# Altium schematic sheet main_board.SchDoc
size A
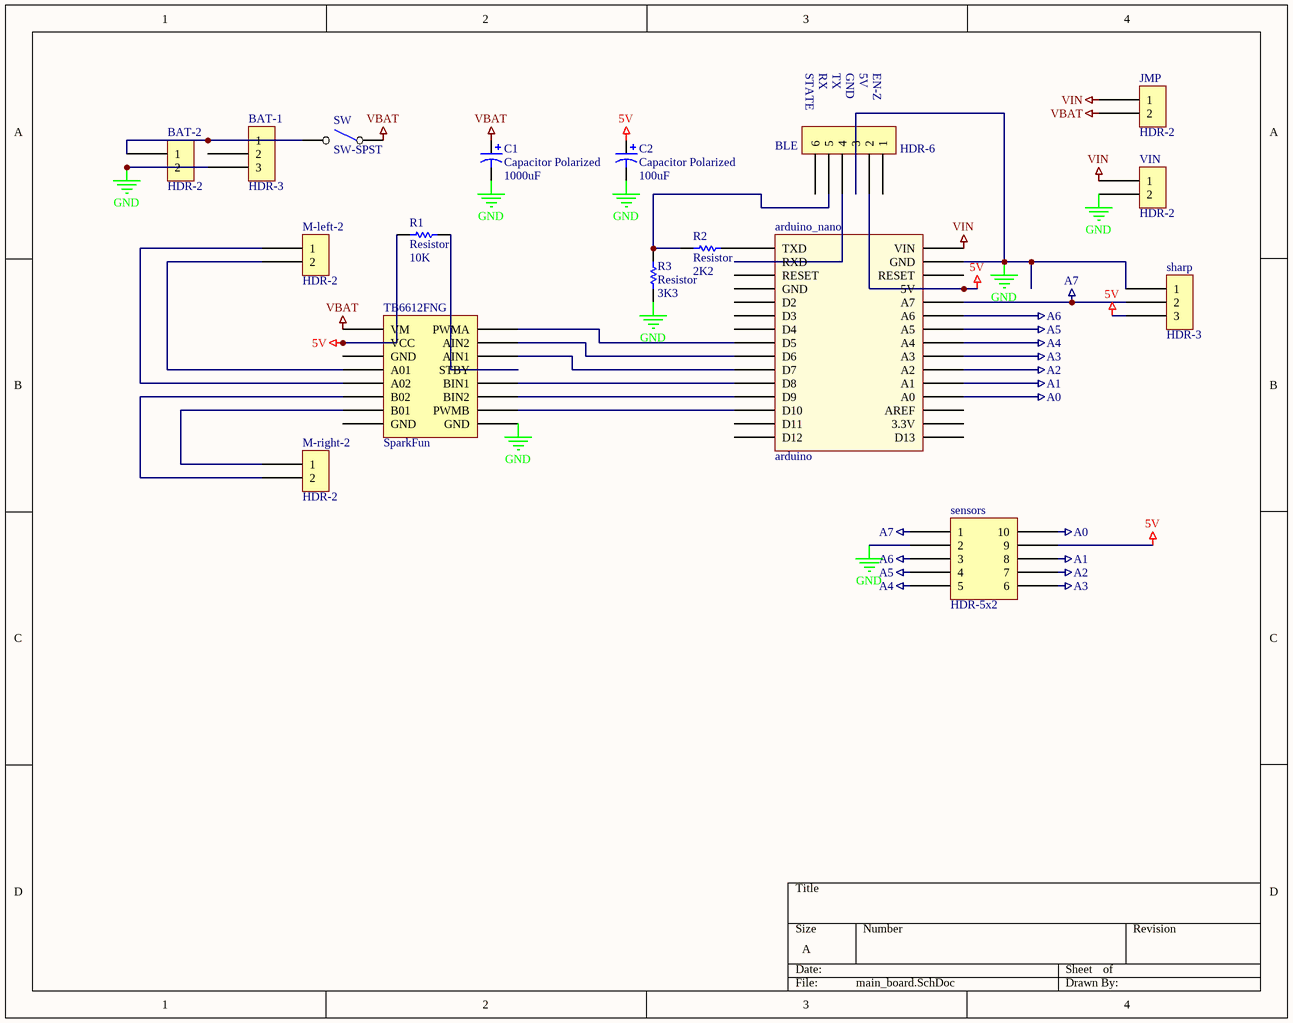
[diagram p0: main_board.SchDoc]

## Parts
arduino_nano  arduino  [Arduino_nano]
BAT-1  HDR-3  [HDR-3]
BAT-2  HDR-2  [HDR-2]
BLE  HDR-6  [HDR-6]
C1  Capacitor Polarized  value 1000uF  [ELCO-2]
C2  Capacitor Polarized  value 100uF  [ELCO-1]
JMP  HDR-2  [HDR-2]
M-left-2  HDR-2  [KLEMA2_SMALL]
M-right-2  HDR-2  [KLEMA2_SMALL]
R1  Resistor  value 10K  [AXIAL-4]
R2  Resistor  value 2K2  [AXIAL-4]
R3  Resistor  value 3K3  [AXIAL-4]
sensors  HDR-5x2  [HDR-5x2 CON]
sharp  HDR-3  [HDR-3]
SW  SW-SPST  [SW-3]
TB6612FNG  SparkFun  [TB6612FNG_SparkFun]
VIN  HDR-2  [HDR-2]

## Nets
5V: arduino_nano.27(5V) BLE.2 C2.1 R1.2 sensors.9 sharp.3 TB6612FNG.2(VCC)
A0: arduino_nano.19(A0) sensors.10
A1: arduino_nano.20(A1) sensors.8
A2: arduino_nano.21(A2) sensors.7
A3: arduino_nano.22(A3) sensors.6
A4: arduino_nano.23(A4) sensors.5
A5: arduino_nano.24(A5) sensors.4
A6: arduino_nano.25(A6) sensors.3
A7: arduino_nano.26(A7) sensors.1 sharp.2
GND: arduino_nano.29(GND) BAT-1.3 BAT-2.2 BLE.3 C1.2 C2.2 R3.2 sensors.2 sharp.1 TB6612FNG.9(GND) VIN.2
VBAT: C1.1 JMP.2 SW.1 TB6612FNG.1(VM)
VIN: arduino_nano.30(VIN) JMP.1 VIN.1
Netarduino_nano_1: arduino_nano.1(TXD) R2.1
Netarduino_nano_2: arduino_nano.2(RXD) BLE.4
Netarduino_nano_8: arduino_nano.8(D5) TB6612FNG.16(PWMA)
Netarduino_nano_9: arduino_nano.9(D6) TB6612FNG.15(AIN2)
Netarduino_nano_10: arduino_nano.10(D7) TB6612FNG.14(AIN1)
Netarduino_nano_11: arduino_nano.11(D8) TB6612FNG.12(BIN1)
Netarduino_nano_12: arduino_nano.12(D9) TB6612FNG.11(BIN2)
Netarduino_nano_13: arduino_nano.13(D10) TB6612FNG.10(PWMB)
NetBAT-1_1: BAT-1.1 BAT-2.1 SW.2
NetBLE_5: BLE.5 R2.2 R3.1
NetM-left-2_1: M-left-2.1 TB6612FNG.5(A02)
NetM-left-2_2: M-left-2.2 TB6612FNG.4(A01)
NetM-right-2_1: M-right-2.1 TB6612FNG.7(B01)
NetM-right-2_2: M-right-2.2 TB6612FNG.6(B02)
NetR1_1: R1.1 TB6612FNG.13(STBY)

Not connected (* = marked no-connect by the designer): arduino_nano 3(RESET) 4(GND) 5(D2) 6(D3) 7(D4) 14(D11) 15(D12) 16(D13) 17(3.3V) 18(AREF) 28(RESET); BAT-1 2; BLE 1 6; TB6612FNG 3(GND) 8(GND)

## Notes on the sheet
- (near BLE) STATE
- RX
- TX
- GND
- 5V
- EN-Z

## Library data of the parts
arduino_nano = Arduino_Nano
TB6612FNG = TB6612FNG_SparkFun
C1 C2 = Capacitor Polarized: Published: 8-Jun-2000; LatestRevisionDate: 17-Jul-2002; LatestRevisionNote: Re-released for DXP Platform.; PackageReference: POLAR0.8; Publisher: Altium Limited
R1-R3 = Resistor: Published: 8-Jun-2000; LatestRevisionDate: 17-Jul-2002; LatestRevisionNote: Re-released for DXP Platform.; PackageReference: AXIAL-0.3; Publisher: Altium Limited